# EAGLE schematic DIP20-2-2.54 (EAGLE 9.7.0)
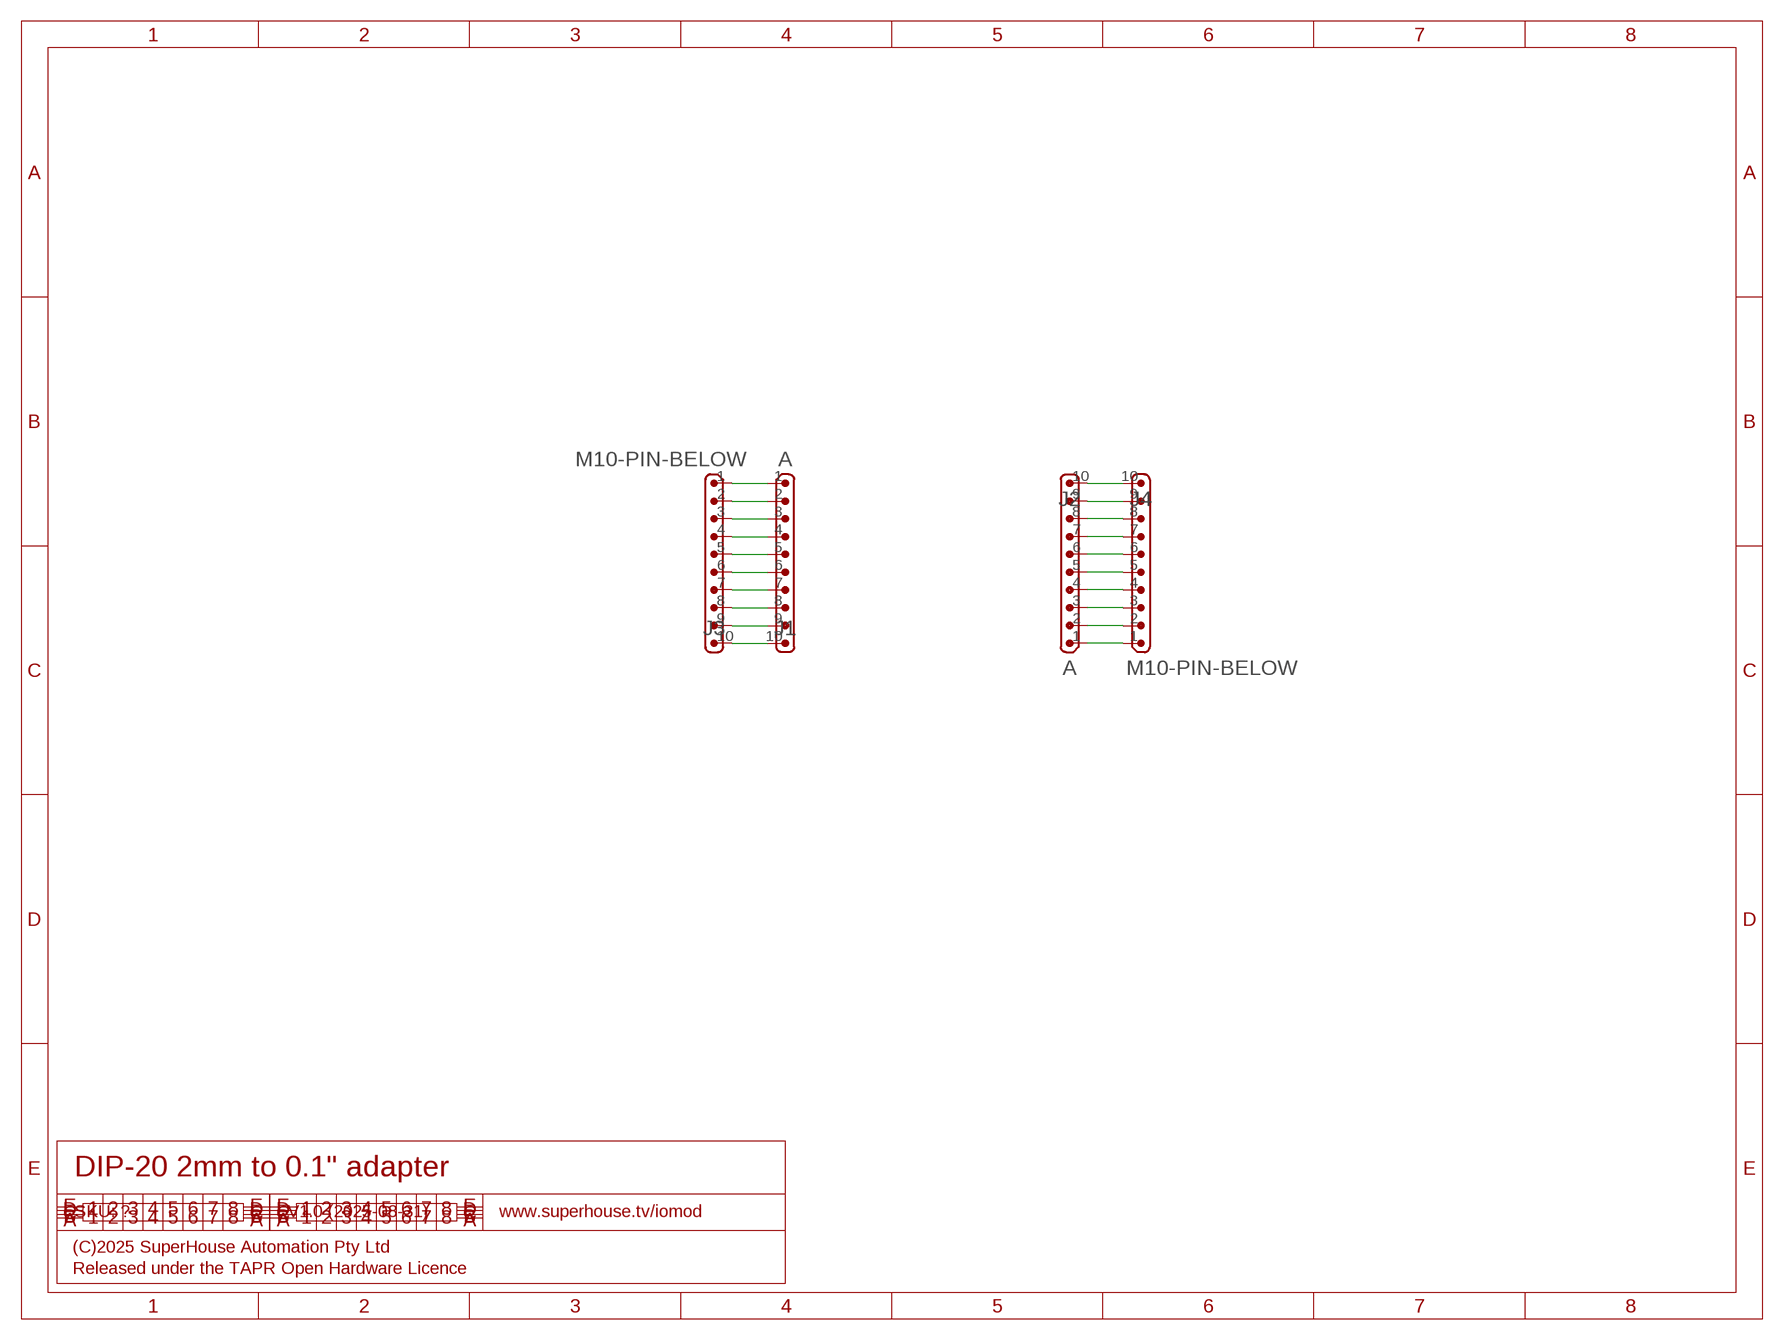
[diagram p0: schematic, sheet 1]

## Parts
J1  A  M10-2.00-S  [1X10-2.00-S]
J2  A  M10-2.00-S  [1X10-2.00-S]
J3  M10-PIN-BELOW  [1X10-P-BELOW]
J4  M10-PIN-BELOW  [1X10-P-BELOW]

## Nets
N$1: J1.1 J3.1
N$2: J1.2 J3.2
N$3: J1.3 J3.3
N$4: J1.4 J3.4
N$5: J1.5 J3.5
N$6: J1.6 J3.6
N$7: J1.7 J3.7
N$8: J1.8 J3.8
N$9: J2.1 J4.1
N$10: J2.2 J4.2
N$11: J2.3 J4.3
N$12: J2.4 J4.4
N$13: J2.5 J4.5
N$14: J2.6 J4.6
N$15: J2.7 J4.7
N$16: J2.8 J4.8
N$17: J1.9 J3.9
N$18: J1.10 J3.10
N$19: J2.9 J4.9
N$20: J2.10 J4.10

## Notes on the sheet
- DIP-20 2mm to 0.1" adapter
- SKU: ? | V1.0 (2025-08-31) | www.superhouse.tv/iomod
- (C)2025 SuperHouse Automation Pty Ltd
- Released under the TAPR Open Hardware Licence

## Library data of the parts
J1-J4 = SuperHouse-Connectors:M10: 10-way header Standard 1x10 header, and screw terminal variations

## Net classes
0 Default: width 0.203 mm
1 VCC: width 0.305 mm